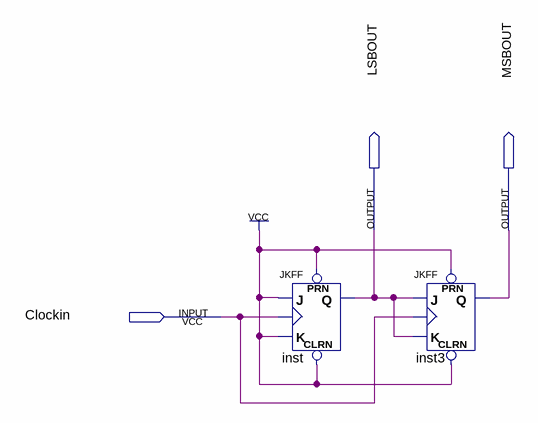
[diagram p0: schematic sheet]
// Quartus schematic MaquinadeState.bdf as structural Verilog: 2 symbols, 3 pins
module MaquinadeState (
  input  Clockin,
  output LSBOUT,
  output MSBOUT
);

  JKFF inst (.PRN(1'b1), .CLRN(1'b1), .K(1'b1), .J(1'b1), .CLK(Clockin), .Q(LSBOUT));
  JKFF inst3 (.PRN(1'b1), .CLRN(1'b1), .K(LSBOUT), .J(LSBOUT), .CLK(Clockin), .Q(MSBOUT));
endmodule
